# EAGLE schematic Modem_rev_b0 (EAGLE 6.5.0)
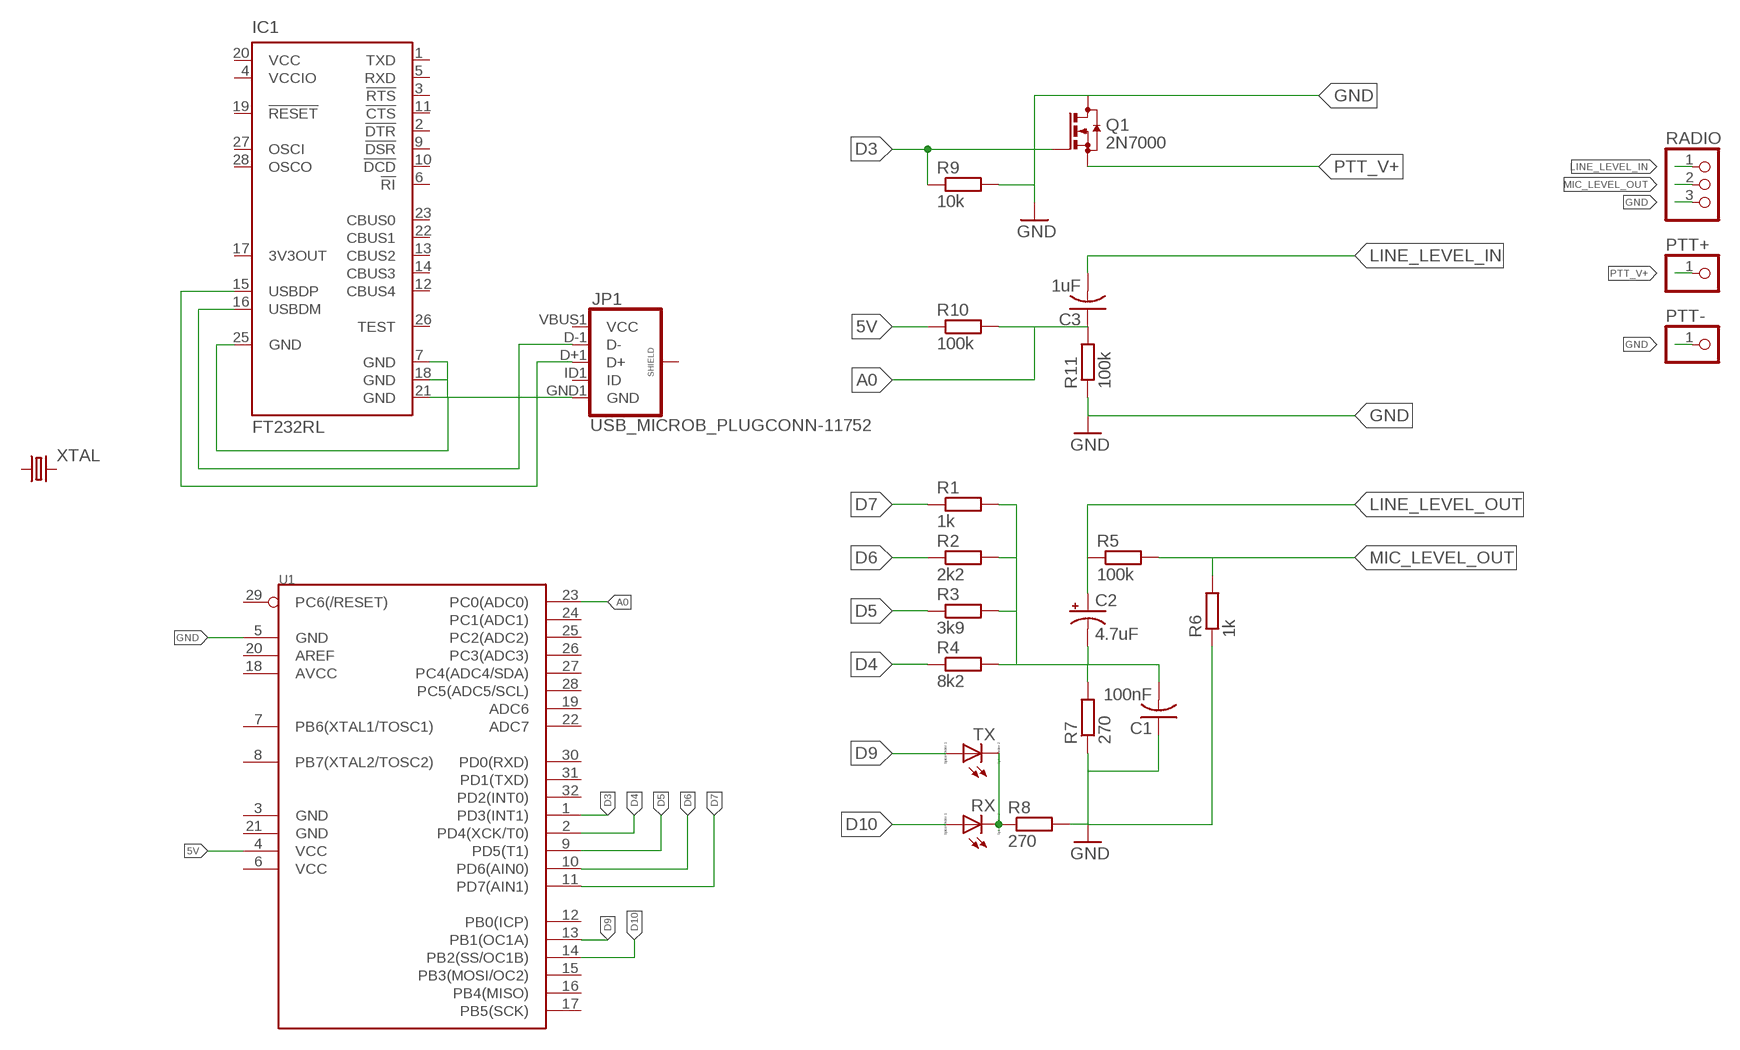
[diagram p0: schematic, sheet 1]

## Parts
C1  100nF  C-USC0603  [C0603]
C2  4.7uF  CPOL-US153CLV-0405  [153CLV-0405]
C3  1uF  C-USC0603  [C0603]
IC1  FT232RL  [SSOP28]
JP1  USB_MICROB_PLUGCONN-11752  [USB-B-MICRO-SMD_V03]
PTT+  PINHD-1X1  [1X01]
PTT-  PINHD-1X1  [1X01]
Q1  2N7000  BSS123  [SOT23]
R1  1k  R-EU_R0603  [R0603]
R2  2k2  R-EU_R0603  [R0603]
R3  3k9  R-EU_R0603  [R0603]
R4  8k2  R-EU_R0603  [R0603]
R5  100k  R-EU_R0603  [R0603]
R6  1k  R-EU_R0603  [R0603]
R7  270  R-EU_R0603  [R0603]
R8  270  R-EU_R0603  [R0603]
R9  10k  R-EU_R0603  [R0603]
R10  100k  R-EU_R0603  [R0603]
R11  100k  R-EU_R0603  [R0603]
RADIO  PINHD-1X3  [1X03]
RX  LED_ELD260  [LED_LD260]
TX  LED_ELD260  [LED_LD260]
U1  ATMEGA328P-AU-1030060P1  [TQFP32]
XTAL  CRYSTALSM49  [SM49]

## Nets
5V: R10.1 U1.4(VCC)
A0: C3.1 R10.2 R11.2 U1.23(PC0(ADC0))
D3: Q1.1(G) R9.1 U1.1(PD3(INT1))
D4: R4.1 U1.2(PD4(XCK/T0))
D5: R3.1 U1.9(PD5(T1))
D6: R2.1 U1.10(PD6(AIN0))
D7: R1.1 U1.11(PD7(AIN1))
D9: TX.A U1.13(PB1(OC1A))
D10: RX.A U1.14(PB2(SS/OC1B))
GND: C1.1 PTT-.1 Q1.3(D) R6.1 R7.1 R8.2 R9.2 R11.1 RADIO.3 U1.5(GND)
LINE_LEVEL_IN: C3.2 RADIO.1
LINE_LEVEL_OUT: C2.+ R5.1
MIC_LEVEL_OUT: R5.2 R6.2 RADIO.2
N$1: R8.1 RX.K(C) TX.K(C)
N$2: IC1.7(GND) IC1.18(GND) IC1.21(GND) IC1.25(GND) JP1.GND1(GND)
N$3: IC1.16(USBDM) JP1.D-1(D-)
N$4: IC1.15(USBDP) JP1.D+1(D+)
N$5: C1.2 C2.- R1.2 R2.2 R3.2 R4.2 R7.2
PTT_V+: PTT+.1 Q1.2(S)
Unconnected: IC1.1(TXD) IC1.2(!DTR) IC1.3(!RTS) IC1.5(RXD) IC1.6(!RI) IC1.9(!DSR) IC1.10(!DCD) IC1.11(!CTS) IC1.12(CBUS4) IC1.13(CBUS2) IC1.14(CBUS3) IC1.17(3V3OUT) IC1.19(!RESET) IC1.22(CBUS1) IC1.23(CBUS0) IC1.26(TEST) IC1.27(OSCI) IC1.28(OSCO) JP1.ID1(ID) JP1.SHIELD1(SHIELD) JP1.SHIELD2(SHIELD) JP1.SHIELD3(SHIELD) JP1.VBUS1(VCC) U1.3(GND) U1.6(VCC) U1.7(PB6(XTAL1/TOSC1)) U1.8(PB7(XTAL2/TOSC2)) U1.12(PB0(ICP)) U1.15(PB3(MOSI/OC2)) U1.16(PB4(MISO)) U1.17(PB5(SCK)) U1.18(AVCC) U1.19(ADC6) U1.20(AREF) U1.21(GND) U1.22(ADC7) U1.24(PC1(ADC1)) U1.25(PC2(ADC2)) U1.26(PC3(ADC3)) U1.27(PC4(ADC4/SDA)) U1.28(PC5(ADC5/SCL)) U1.29(PC6(/RESET)) U1.30(PD0(RXD)) U1.31(PD1(TXD)) U1.32(PD2(INT0)) XTAL.1 XTAL.2

## Power pins joined to a net without a drawn wire
VCC: IC1.20(VCC)
VCCIO: IC1.4(VCCIO)

## Library data of the parts
C1 C3 = adafruit:C-US: CAPACITOR, American symbol
C2 = adafruit:CPOL-US: POLARIZED CAPACITOR, American symbol
IC1 = ftdichip:FT232R: Source: http://www.ftdichip.com/Documents/DataSheets/DS_FT232R_v104.pdf; MPN: FT232RL; OC_FARNELL: 1146032; OC_NEWARK: 91K9918
JP1 = SparkFun-Connectors:USB_MICROB_PLUG: USB Micro-B connectors Some male, some female. Watch your step!; PROD_ID: CONN-11752
PTT+ PTT- = adafruit:PINHD-1X1: Pin header 1x1 for 0.1" spacing With round pins
Q1 = transistor-small-signal:BSS123: N-CHANNEL MOS FET
R1-R8 = resistor:R-EU_: RESISTOR, European symbol
R9-R11 = rcl:R-EU_: RESISTOR, European symbol
RADIO = adafruit:PINHD-1X3: PIN HEADER
RX TX = eagle-ltspice:LED_E: LED Source: http://www.osram.convergy.de Source: www.luxeon.com Source: www.kingbright.com; SPICEMODEL: NONE; SPICEPREFIX: D; SPICETYPE: diode
U1 = OPL:ATMEGA328P-AU: 8-bit AVR Microcontroller with 32K Bytes In-System Programmable Flash
XTAL = adafruit:CRYSTAL: CRYSTAL; OC_FARNELL: unknown; OC_NEWARK: unknown